# Altium project eTraceConcrete_V1_1.PrjPcb (part 2 of 7)

## Sheet battery.SchDoc
size A2
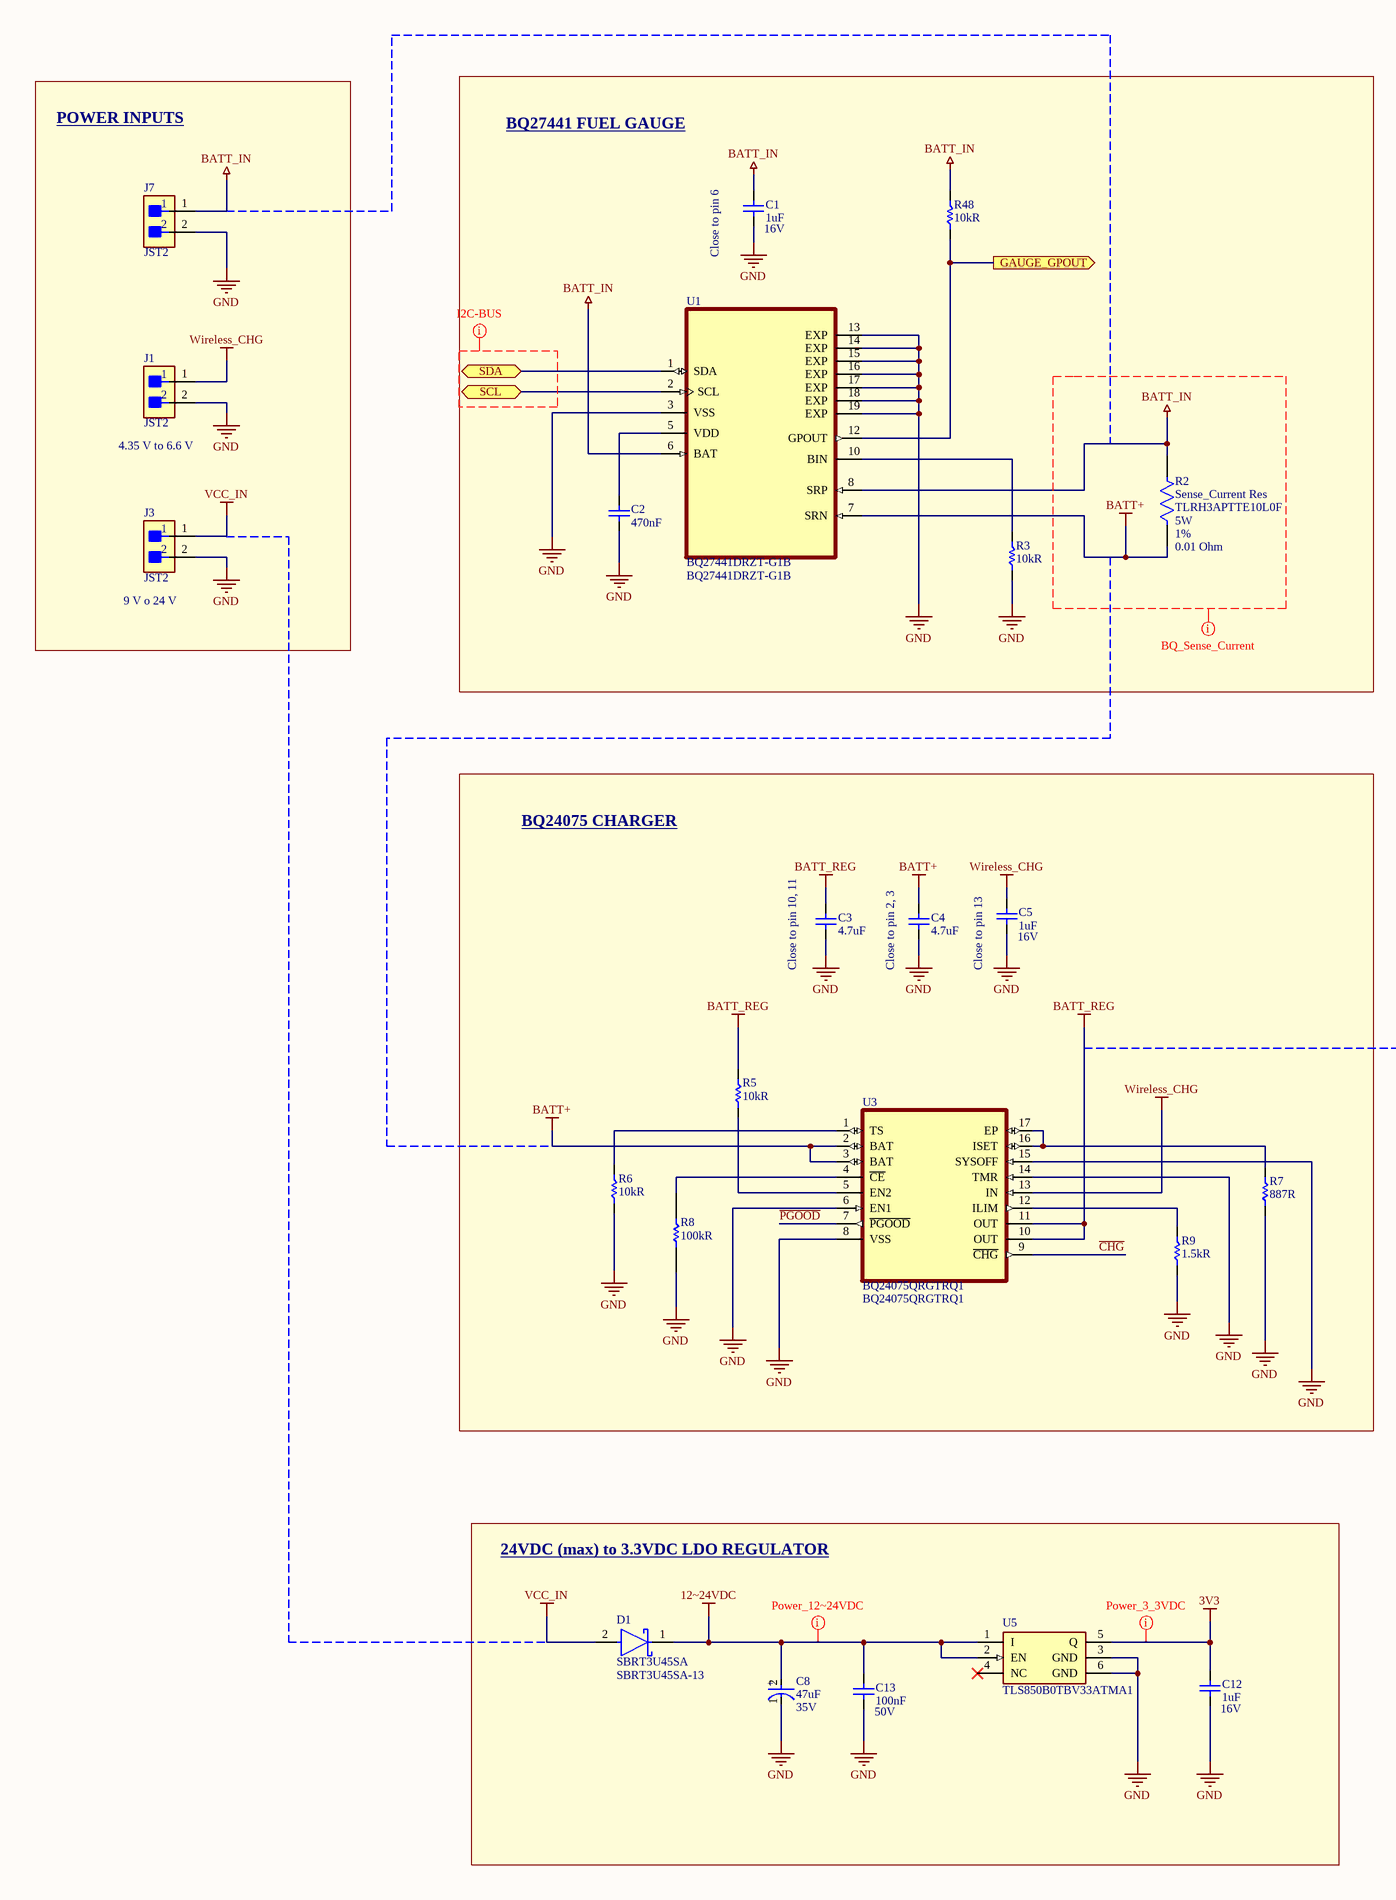
[diagram p1: battery.SchDoc, left]
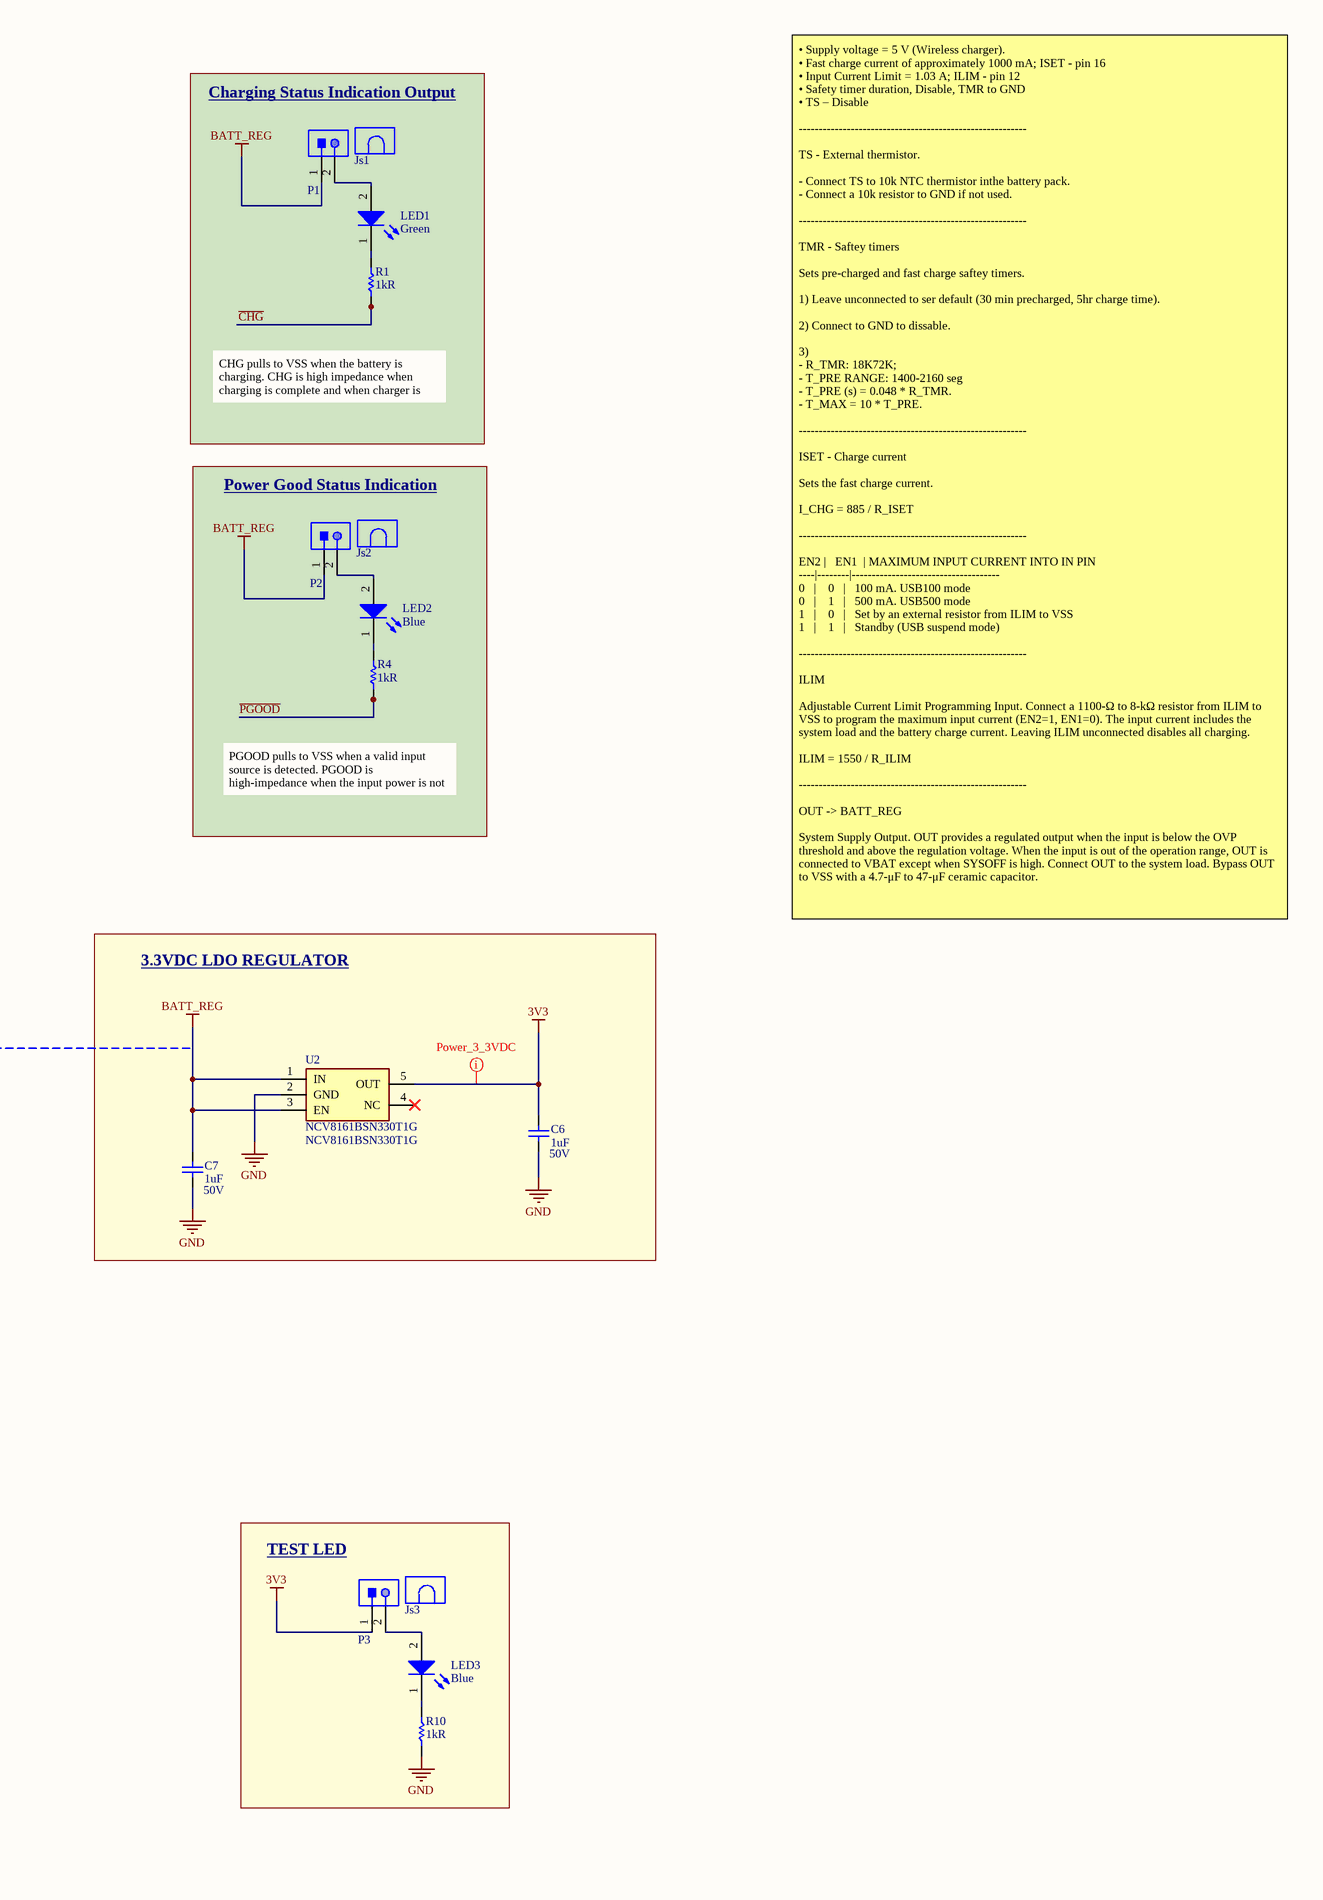
[diagram p2: battery.SchDoc, right]

### Parts
C1  1uF  Voltage Rating: 16V  [Cap 0805 (2012 Metric)]
C2  470nF  [Cap 0805 (2012 Metric)]
C3  4.7uF  [Cap 0805 (2012 Metric)]
C4  4.7uF  [Cap 0805 (2012 Metric)]
C5  1uF  Voltage Rating: 16V  [Cap 0805 (2012 Metric)]
C6  1uF  Voltage Rating: 50V  [Cap 0805 (2012 Metric)]
C7  1uF  Voltage Rating: 50V  [Cap 0805 (2012 Metric)]
C8  Capacitance: 47uF  Voltage: 35V  [EEE-FK1V470P]  (hidden comment: EEE-FK1V470P)
C12  1uF  Voltage Rating: 16V  [Cap 0805 (2012 Metric)]
C13  100nF  Voltage Rating: 50V  [Cap 0805 (2012 Metric)]
D1  SBRT3U45SA  [SBRT3U45SA-13]
J1  JST2  [JST2]
J3  JST2  [JST2]
J7  JST2  [JST2]
Js1  Jumper (2x1)  [Header JMP 2x1]  (value not drawn)
Js2  Jumper (2x1)  [Header JMP 2x1]  (value not drawn)
Js3  Jumper (2x1)  [Header JMP 2x1]  (value not drawn)
LED1  Green  [LED 0805(2012 METRIC)]
LED2  Blue  [LED 0805(2012 METRIC)]
LED3  Blue  [LED 0805(2012 METRIC)]
P1  Header 2x1  [Header 2x1]  (value not drawn)
P2  Header 2x1  [Header 2x1]  (value not drawn)
P3  Header 2x1  [Header 2x1]  (value not drawn)
R1  1kR  [Res 0805 (2012 Metric)]
R2  Sense_Current Res  value 0.01 Ohm  Manufacturer Part Number: TLRH3APTTE10L0F  Power: 5W  Tolerance: 1%  [Sense_Current Res]
R3  10kR  [Res 0805 (2012 Metric)]
R4  1kR  [Res 0805 (2012 Metric)]
R5  10kR  [Res 0805 (2012 Metric)]
R6  10kR  [Res 0805 (2012 Metric)]
R7  887R  [Res 0805 (2012 Metric)]
R8  100kR  [Res 0805 (2012 Metric)]
R9  1.5kR  [Res 0805 (2012 Metric)]
R10  1kR  [Res 0805 (2012 Metric)]
R48  10kR  [Res 0805 (2012 Metric)]
U1  BQ27441DRZT-G1B  [BQ27441DRZT-G1B]
U2  NCV8161BSN330T1G  [NCV8161BSN330T1G]
U3  BQ24075QRGTRQ1  [BQ24075QRGTRQ1]
U5  TLS850B0TBV33ATMA1  [TLS850B0TBV33ATMA1]

### Blocks framed on the sheet
POWER INPUTS: J1 J3 J7
BQ27441 FUEL GAUGE: C1 C2 R2 R3 R48 U1
Charging Status Indication Output: Js1 LED1 P1 R1
Power Good Status Indication: Js2 LED2 P2 R4
BQ24075 CHARGER: C3-C5 R5-R9 U3
3.3VDC LDO REGULATOR: C6 C7 U2
24VDC (max) to 3.3VDC LDO REGULATOR: C8 C12 C13 D1 U5
TEST LED: Js3 LED3 P3 R10

### Ports
GAUGE_GPOUT (out), SCL (bidir), SDA (bidir)

### Nets
3V3: C6.1 C12.1 P3.1 U2.5(OUT) U5.5(Q)
12~24VDC: C8.2(A) C13.1 D1.1(C) U5.1(I) U5.2(EN)
BATT+: C4.1 R2.1 U1.7(SRN) U3.2(BAT) U3.3(BAT)
BATT_IN: C1.1 J7.1 R2.2 R48.1 U1.6(BAT) U1.8(SRP)
BATT_REG: C3.1 C7.1 P1.1 P2.1 R5.1 U2.1(IN) U2.3(EN) U3.10(OUT) U3.11(OUT)
GND: C1.2 C2.2 C3.2 C4.2 C5.2 C6.2 C7.2 C8.1(C) C12.2 C13.2 J1.2 J3.2 J7.2 R3.2 R6.2 R7.2 R8.2 R9.2 R10.2 U1.3(VSS) U1.13(EXP) U1.14(EXP) U1.15(EXP) U1.16(EXP) U1.17(EXP) U1.18(EXP) U1.19(EXP) U2.2(GND) U3.6(EN1) U3.8(VSS) U3.14(TMR) U3.15(SYSOFF) U5.3(GND) U5.6(GND)  [project net BS]
VCC_IN: D1.2(A) J3.1
Wireless_CHG: C5.1 J1.1 U3.13(IN)
~{CHG}: R1.2 U3.9(~{CHG})
~{PGOOD}: R4.2 U3.7(~{PGOOD})
SCL: U1.2(SCL) ; port SCL
SDA: U1.1(SDA) ; port SDA
NetC2_1: C2.1 U1.5(VDD)
NetLED1_1: LED1.1(K) R1.1
NetLED1_2: LED1.2(A) P1.2
NetLED2_1: LED2.1(K) R4.1
NetLED2_2: LED2.2(A) P2.2
NetLED3_1: LED3.1(K) R10.1
NetLED3_2: LED3.2(A) P3.2
NetR3_1: R3.1 U1.10(BIN)
NetR5_2: R5.2 U3.5(EN2)
NetR6_1: R6.1 U3.1(TS)
NetR7_1: R7.1 U3.16(ISET) U3.17(EP)
NetR8_1: R8.1 U3.4(~{CE})
NetR9_1: R9.1 U3.12(ILIM)
NetR48_2: R48.2 U1.12(GPOUT) ; port GAUGE_GPOUT

Not connected (* = marked no-connect by the designer): U2 4(NC)*; U5 4(NC)*

### Layout directives
net class BQ_Sense_Current: BATT+, BATT_IN
net class Power_12~24VDC: 12~24VDC
net class Power_3_3VDC: 3V3
net class I2C-BUS: (no net found under the mark)

### Notes on the sheet
- (near C1) Close to pin 6
- CHG pulls to VSS when the battery is charging. CHG is high impedance when charging is complete and when charger is disabled.
- (near J1) 4.35 V to 6.6 V
- (near J3) 9 V o 24 V
- PGOOD pulls to VSS when a valid input source is detected. PGOOD is high-impedance when the input power is not within specified limits.
- • Supply voltage = 5 V (Wireless charger).
  • Fast charge current of approximately 1000 mA; ISET - pin 16
  • Input Current Limit = 1.03 A; ILIM - pin 12
  • Safety timer duration, Disable, TMR to GND
  • TS – Disable
  ---------------------------------------------------------
  TS - External thermistor.
  - Connect TS to 10k NTC thermistor inthe battery pack.
  - Connect a 10k resistor to GND if not used.
  ---------------------------------------------------------
  TMR - Saftey timers
  Sets pre-charged and fast charge saftey timers.
  1) Leave unconnected to ser default (30 min precharged, 5hr charge time).
  2) Connect to GND to dissable.
  3)
  - R_TMR: 18K72K;
  - T_PRE RANGE: 1400-2160 seg
  - T_PRE (s) = 0.048 * R_TMR.
  - T_MAX = 10 * T_PRE.
  ---------------------------------------------------------
  ISET - Charge current
  Sets the fast charge current.
  I_CHG = 885 / R_ISET
  ---------------------------------------------------------
  EN2 |   EN1  | MAXIMUM INPUT CURRENT INTO IN PIN
  ----|--------|-------------------------------------
  0   |    0   |   100 mA. USB100 mode
  0   |    1   |   500 mA. USB500 mode
  1   |    0   |   Set by an external resistor from ILIM to VSS
  1   |    1   |   Standby (USB suspend mode)
  ---------------------------------------------------------
  ILIM
  Adjustable Current Limit Programming Input. Connect a 1100-Ω to 8-kΩ resistor from ILIM to VSS to program the maximum input current (EN2=1, EN1=0). The input current includes the system load and the battery charge current. Leaving ILIM unconnected disables all charging.
  ILIM = 1550 / R_ILIM
  ---------------------------------------------------------
  OUT -> BATT_REG
  System Supply Output. OUT provides a regulated output when the input is below the OVP threshold and above the regulation voltage. When the input is out of the operation range, OUT is connected to VBAT except when SYSOFF is high. Connect OUT to the system load. Bypass OUT to VSS with a 4.7-μF to 47-μF ceramic capacitor.
- (near C3) Close to pin 10, 11
- (near C4) Close to pin 2, 3
- (near C5) Close to pin 13
- (in symbol EEE-FK1V470P) +

### Library data of the parts
C1 C5 C12 = Capacitor: Ceramic capacitor SMD-0805 1000nF /16V X7R# K +-10%, Samsung, RoHS/3000pcs/; Manufacturer Part Number: CL21B105KOFNNNG; Tolerance: 10%; Dielectric: X7R; Link: https://www.digikey.com/es/products/detail/samsung-electro-mechanics/CL21B105KOFNNNG/3894469?s=N4IgTCBcDaIMIBkwEYBCyAMBWA0geQDEA5EgcRAF0BfIA; Supplier 1: Digi-Key; Supplier Part Number 1: 1276-6471-1-ND; Manufacturer: Samsung; RoHS: Yes; Category: Ceramic Capacitors; Stock 1: 36000; Pricing 1: 1=0,10000, 10=0,05700, 50=0,03120, 100=0,02540, 500=0,01816, 1000=0,01426 (USD); Mount: Surface Mount; Case/Package: 0805; Case Code (Metric): 2012; Case Code (Imperial): 0805; Material: Ceramic; Min Operating Temperature: -55°C; Max Operating Temperature: 125°C; Package Quantity: 3000; Packaging: Tape and Reel; Capacitance: 1uF; Voltage: 16V; Series: CL; Length: 2mm; Width: 0.049inch; Height: 1.25mm; Thickness: 0.053inch; Depth: 1.25mm; Lead Free: Lead Free; ComponentLink1URL: https://datasheet.ciiva.com/25733/cl21b105kofnnng-25733281.pdf?src-supplier=Digi-Key; ComponentLink1Description: https://datasheet.ciiva.com/25733/cl21b105kofnnng-25733281.pdf?src-supplier=Digi-Key; ComponentLink2URL: https://datasheet.ciiva.com/29199/455935-da-01-en-vs-kondensator-0805-29199047.pdf?src-supplier=Conrad; ComponentLink2Description: https://datasheet.ciiva.com/29199/455935-da-01-en-vs-kondensator-0805-29199047.pdf?src-supplier=Conrad; ComponentLink3URL: https://datasheet.ciiva.com/16428/cl05b104kq5nnnc-16428885.pdf?src-supplier=Future+Electronics; ComponentLink3Description: https://datasheet.ciiva.com/16428/cl05b104kq5nnnc-16428885.pdf?src-supplier=Future+Electronics; ComponentLink4URL: https://datasheet.ciiva.com/26310/mlcc-catalogdownload2013-eng-26310156.pdf?src-supplier=Distrelec; ComponentLink4Description: https://datasheet.ciiva.com/26310/mlcc-catalogdownload2013-eng-26310156.pdf?src-supplier=Distrelec
C2 = Capacitor: CAP CER 0.47UF 25V X7R 0805; Manufacturer: Samsung; Manufacturer Part Number: CL21B474KAFNNNE; Tolerance: 10%; Link: https://www.digikey.com/en/products/detail/samsung-electro-mechanics/CL21B474KAFNNNE/3886732; Supplier 1: Digi-Key; Supplier Part Number 1: 1276-1074-1-ND; RoHS: Yes; Category: Ceramic Capacitors; Stock 1: 290187; Pricing 1: 1=0,10000, 10=0,05400, 50=0,02920, 100=0,02390, 500=0,01706, 1000=0,01341 (USD); Mount: Surface Mount; Case/Package: 0805; Case Code (Metric): 2012; Case Code (Imperial): 0805; Contact Plating: Tin; Min Operating Temperature: -55°C; Max Operating Temperature: 125°C; Capacitance: 470nF; Dielectric: X7R; Package Quantity: 1; Packaging: Tape and Reel; Voltage Rating: 25V; Series: CL; Construction: Flat; Voltage Rating (DC): 25V; Length: 2mm; Width: 0.049inch; Height: 1.25mm; Thickness: 0.053inch; Depth: 1.25mm; Radiation Hardening: No; RoHS Compliant: Yes; Lead Free: Lead Free; ComponentLink1URL: https://datasheet.ciiva.com/25799/cl21b474kafnnne-25799985.pdf?src-supplier=Digi-Key; ComponentLink1Description: https://datasheet.ciiva.com/25799/cl21b474kafnnne-25799985.pdf?src-supplier=Digi-Key; ComponentLink2URL: https://datasheet.ciiva.com/26838/getdatasheetpartid-640001-26838737.pdf?src-supplier=Verical; ComponentLink2Description: https://datasheet.ciiva.com/26838/getdatasheetpartid-640001-26838737.pdf?src-supplier=Verical
C3 C4 = Capacitor: SAMSUNG ELECTRO-MECHANICS - CL21A475KAQNNNE - SMD Multilayer Ceramic Capacitor, 4.7 µF, 25 V, 0805 [2012 Metric], ± 10%, X5R, CL Series; Voltage Rating: 25V; Link: https://www.digikey.com/en/products/detail/samsung-electro-mechanics/CL21A475KAQNNNE/3886902; Supplier 1: Digi-Key; Supplier Part Number 1: 1276-1244-1-ND; Manufacturer: Samsung; Manufacturer Part Number: CL21A475KAQNNNE; RoHS: Yes; Category: Ceramic Capacitors; Stock 1: 218144; Pricing 1: 1=0,12000, 10=0,08300, 50=0,04720, 100=0,03910, 500=0,02740, 1000=0,02268 (USD); Mount: Surface Mount; Case/Package: 0805; Case Code (Metric): 2012; Case Code (Imperial): 0805; Min Operating Temperature: -55°C; Max Operating Temperature: 85°C; Package Quantity: 1; Packaging: Tape and Reel; Capacitance: 4.7uF; Tolerance: 10%; Dielectric: X5R; Voltage Rating (DC): 25V; Series: CL; Construction: Flat; Length: 2mm; Width: 0.049inch; Height: 1.25mm; Thickness: 0.055inch; Depth: 1.25mm; Radiation Hardening: No; Lead Free: Lead Free; RoHS Compliant: Yes; ComponentLink1URL: https://datasheet.ciiva.com/25798/cl21a475kaqnnne-25798882.pdf?src-supplier=Digi-Key; ComponentLink1Description: https://datasheet.ciiva.com/25798/cl21a475kaqnnne-25798882.pdf?src-supplier=Digi-Key
C6 C7 = Capacitor: Cap Ceramic 1uF 50V Y5V -20% to 80% SMD 0805 85C T/R; Manufacturer: Samsung; Manufacturer Part Number: CL21F105ZBFNNNG; Link: https://www.digikey.com/en/products/detail/samsung-electro-mechanics/CL21F105ZBFNNNG/3894627; Supplier 1: Digi-Key; Supplier Part Number 1: 1276-6495-1-ND; RoHS: Yes; Category: Ceramic Capacitors; Stock 1: 53286; Pricing 1: 1=0,14000, 10=0,10300, 50=0,05840, 100=0,04840, 500=0,03396, 1000=0,02811 (USD); Mount: Surface Mount; Case/Package: 0805; Case Code (Metric): 2012; Case Code (Imperial): 0805; Material: Ceramic; Min Operating Temperature: -30°C; Max Operating Temperature: 85°C; Tolerance: 80%; Packaging: Tape and Reel; Capacitance: 1uF; Package Quantity: 3000; Dielectric: Y5V; Length: 2mm; Width: 0.049inch; Thickness: 0.053inch; Depth: 1.25mm; Radiation Hardening: No; Lead Free: Lead Free; RoHS Compliant: Yes; ComponentLink1URL: https://datasheet.ciiva.com/25734/cl21f105zbfnnng-25734639.pdf?src-supplier=Digi-Key; ComponentLink1Description: https://datasheet.ciiva.com/25734/cl21f105zbfnnng-25734639.pdf?src-supplier=Digi-Key; ComponentLink2URL: https://datasheet.ciiva.com/26838/getdatasheetpartid-650871-26838829.pdf?src-supplier=Verical; ComponentLink2Description: https://datasheet.ciiva.com/26838/getdatasheetpartid-650871-26838829.pdf?src-supplier=Verical; ComponentLink3URL: https://datasheet.ciiva.com/29199/455947-da-01-en-vs-kondensator-0805-29199048.pdf?src-supplier=Conrad; ComponentLink3Description: https://datasheet.ciiva.com/29199/455947-da-01-en-vs-kondensator-0805-29199048.pdf?src-supplier=Conrad; ComponentLink4URL: https://datasheet.ciiva.com/26310/mlcc-catalogdownload2013-eng-26310157.pdf?src-supplier=Distrelec; ComponentLink4Description: https://datasheet.ciiva.com/26310/mlcc-catalogdownload2013-eng-26310157.pdf?src-supplier=Distrelec; ComponentLink5URL: https://datasheet.ciiva.com/16437/cl05b104kq5nnnc-16437223.pdf?src-supplier=Future+Electronics; ComponentLink5Description: https://datasheet.ciiva.com/16437/cl05b104kq5nnnc-16437223.pdf?src-supplier=Future+Electronics
C8 = EEE-FK1V470P: Capacitor 47 uF 35 VDC, EEEFK1V470P, Panasonic Automotive & Industrial Systems; Dielectric Material: Aluminium; Tolerance: 20%; Ripple Current: 240mA; Polarity: Polar; Life (Hours): 2000Hour; ESR (Equivalent Series Resistance): 360mR; Leakage Current: 3uA; Supplier 1: Future Electronics; Manufacturer: Panasonic; RoHS: Yes; Category: Aluminum Electrolytic Capacitors; Stock 1: 165; Mount: Surface Mount,PCB; Case/Package: Radial; Number of Pins: 2; Material: Aluminium; Contact Plating: Tin; Min Operating Temperature: -55°C; Max Operating Temperature: 105°C; Packaging: Tape and Reel; Voltage Rating: 35V; Package Quantity: 1000; Termination: SMD/SMT; Ripple Current (AC): 240mA; Voltage Rating (DC): 35V; Series: FK; Construction: Cylindrical; Diameter: 6.3mm; Length: 5.8mm; Width: 7.8mm; Height: 5.8mm; Height - Seated (Max): 0.24inch; Radiation Hardening: No; RoHS Compliant: Yes; REACH SVHC: No SVHC; Lead Free: Lead Free; ComponentLink1URL: https://datasheet.ciiva.com/11777/0900766b80e4e8b0-11777384.pdf?src-supplier=RSComponents; ComponentLink1Description: https://datasheet.ciiva.com/11777/0900766b80e4e8b0-11777384.pdf?src-supplier=RSComponents; ComponentLink2URL: https://datasheet.ciiva.com/34302/1358354-34302248.pdf?src-supplier=Jameco; ComponentLink2Description: https://datasheet.ciiva.com/34302/1358354-34302248.pdf?src-supplier=Jameco; ComponentLink3URL: https://datasheet.ciiva.com/29313/443478-da-01-en-smd-elko-vfk-d-47-uf-35v-29313582.pdf?src-supplier=Conrad; ComponentLink3Description: https://datasheet.ciiva.com/29313/443478-da-01-en-smd-elko-vfk-d-47-uf-35v-29313582.pdf?src-supplier=Conrad; ComponentLink4URL: https://datasheet.ciiva.com/10327/aba0000ce120-10327226.pdf?src-supplier=Avnet; ComponentLink4Description: https://datasheet.ciiva.com/10327/aba0000ce120-10327226.pdf?src-supplier=Avnet; ComponentLink5URL: https://datasheet.ciiva.com/5949/1676921-5949767.pdf?src-supplier=Farnell; ComponentLink5Description: https://datasheet.ciiva.com/5949/1676921-5949767.pdf?src-supplier=Farnell; ComponentLink6URL: https://datasheet.ciiva.com/2983/aba0000ce120-2983977.pdf?src-supplier=Avnet; ComponentLink6Description: https://datasheet.ciiva.com/2983/aba0000ce120-2983977.pdf?src-supplier=Avnet; ComponentLink7URL: https://datasheet.ciiva.com/24022/aba0000ce120-24022141.pdf?src-supplier=Mouser; ComponentLink7Description: https://datasheet.ciiva.com/24022/aba0000ce120-24022141.pdf?src-supplier=Mouser; ComponentLink8URL: https://datasheet.ciiva.com/46388/1676921-46388169.pdf?src-supplier=Element14; ComponentLink8Description: https://datasheet.ciiva.com/46388/1676921-46388169.pdf?src-supplier=Element14; ComponentLink9URL: https://datasheet.ciiva.com/16449/aba0000ce120-16449455.pdf?src-supplier=Future+Electronics; ComponentLink9Description: https://datasheet.ciiva.com/16449/aba0000ce120-16449455.pdf?src-supplier=Future+Electronics; ComponentLink10URL: https://datasheet.ciiva.com/14592/70068178-14592806.pdf?src-supplier=Allied+Electronics; ComponentLink10Description: https://datasheet.ciiva.com/14592/70068178-14592806.pdf?src-supplier=Allied+Electronics; ComponentLink11URL: https://datasheet.ciiva.com/46376/1676921-46376749.pdf?src-supplier=Element14; ComponentLink11Description: https://datasheet.ciiva.com/46376/1676921-46376749.pdf?src-supplier=Element14; ComponentLink12URL: https://datasheet.ciiva.com/48524/fk-eng-tds-48524111.pdf?src-supplier=Distrelec; ComponentLink12Description: https://datasheet.ciiva.com/48524/fk-eng-tds-48524111.pdf?src-supplier=Distrelec; ComponentLink13URL: https://datasheet.ciiva.com/14605/70258115-14605496.pdf?src-supplier=Allied+Electronics; ComponentLink13Description: https://datasheet.ciiva.com/14605/70258115-14605496.pdf?src-supplier=Allied+Electronics; ComponentLink14URL: https://datasheet.ciiva.com/14608/70258115-14608444.pdf?src-supplier=Allied+Electronics; ComponentLink14Description: https://datasheet.ciiva.com/14608/70258115-14608444.pdf?src-supplier=Allied+Electronics; Link: https://www.digikey.com/es/products/detail/panasonic-electronic-components/EEE-FK1V470P/766010?s=N4IgTCBcDaIKIILQDEDSBGAagFgOwAYAFEAXQF8g; Supplier Part Number 1: 5098671; Manufacturer Part Number: EEEFK1V470P; Pricing 1: 1=0,42500, 50=0,32500, 100=0,30500, 250=0,29000, 500=0,27500 (USD); Impedance: 360mR
C13 = Capacitor: YAGEO (PHYCOMP)         CC0805ZRY5V9BB104             SMD Multilayer Ceramic Capacitor, 0805 [2012 Metric], 0.1 uF, 50 V, +80%, -20%, Y5V, CC Series; Tolerance: 80%; Link: https://www.digikey.com/es/products/detail/yageo/CC0805ZRY5V9BB104/2103099?s=N4IgTCBcDaIMJwAwA5EFYBaAlAmmgagJwBCxAjIgCwgC6AvkA; Supplier 1: Digi-Key; Supplier Part Number 1: 311-1361-1-ND; Manufacturer: Yageo; Manufacturer Part Number: CC0805ZRY5V9BB104; RoHS: Yes; Category: Ceramic Capacitors; Stock 1: 92689; Pricing 1: 1=0,10000, 10=0,07000, 50=0,03800, 100=0,03100, 500=0,02214, 1000=0,01739 (USD); Mount: Surface Mount; Case/Package: 0805; Number of Pins: 2; Case Code (Metric): 2012; Case Code (Imperial): 0805; Material: Ceramic; Dielectric Material: Ceramic; Min Operating Temperature: -30°C; Max Operating Temperature: 85°C; Capacitance: 100nF; Dielectric: Y5V; Package Quantity: 1; Packaging: Tape and Reel; Voltage Rating (DC): 50V; Termination: SMD/SMT; Resistor Type: Ceramic; Series: CC; Construction: Flat; Length: 2mm; Width: 0.049inch; Height: 0.6mm; Depth: 1.25mm; Thickness: 0.024inch; Radiation Hardening: No; REACH SVHC: No SVHC; Lead Free: Lead Free; Halogen Free: Halogen Free; RoHS Compliant: Yes; ComponentLink1URL: https://datasheet.ciiva.com/144/mlccorderingcode-144209.pdf?src-supplier=Digi-Key; ComponentLink1Description: https://datasheet.ciiva.com/144/mlccorderingcode-144209.pdf?src-supplier=Digi-Key; ComponentLink2URL: https://datasheet.ciiva.com/144/mlccorderingcode-144210.pdf?src-supplier=Digi-Key; ComponentLink2Description: https://datasheet.ciiva.com/144/mlccorderingcode-144210.pdf?src-supplier=Digi-Key; ComponentLink3URL: https://datasheet.ciiva.com/144/mlccorderingcode-144211.pdf?src-supplier=Digi-Key; ComponentLink3Description: https://datasheet.ciiva.com/144/mlccorderingcode-144211.pdf?src-supplier=Digi-Key; ComponentLink4URL: https://datasheet.ciiva.com/11465/upy-gphc-y5v-6-3v-to-50v-5-11465865.pdf?src-supplier=Avnet; ComponentLink4Description: https://datasheet.ciiva.com/11465/upy-gphc-y5v-6-3v-to-50v-5-11465865.pdf?src-supplier=Avnet; ComponentLink5URL: https://datasheet.ciiva.com/13389/upy-gp-np0-16v-to-50v-8-13389351.pdf?src-supplier=Mouser; ComponentLink5Description: https://datasheet.ciiva.com/13389/upy-gp-np0-16v-to-50v-8-13389351.pdf?src-supplier=Mouser; ComponentLink6URL: https://datasheet.ciiva.com/17435/upy-gphc-y5v-6-3v-to-50v-5-17435053.pdf?src-supplier=Avnet+Europe; ComponentLink6Description: https://datasheet.ciiva.com/17435/upy-gphc-y5v-6-3v-to-50v-5-17435053.pdf?src-supplier=Avnet+Europe; ComponentLink7URL: https://datasheet.ciiva.com/15189/getdatasheetpartid-55882-15189238.pdf?src-supplier=Verical; ComponentLink7Description: https://datasheet.ciiva.com/15189/getdatasheetpartid-55882-15189238.pdf?src-supplier=Verical; ComponentLink8URL: https://datasheet.ciiva.com/16747/upy-gphc-y5v-6-3v-to-50v-5-revised-16747323.pdf?src-supplier=Future+Electronics; ComponentLink8Description: https://datasheet.ciiva.com/16747/upy-gphc-y5v-6-3v-to-50v-5-revised-16747323.pdf?src-supplier=Future+Electronics; ComponentLink9URL: https://datasheet.ciiva.com/28450/1132289-28450870.pdf?src-supplier=Element14; ComponentLink9Description: https://datasheet.ciiva.com/28450/1132289-28450870.pdf?src-supplier=Element14; ComponentLink10URL: https://datasheet.ciiva.com/29241/445331-da-01-en-kerko-chip-0805-y5v0-1uf-20-80proz50vg-29241946.pdf?src-supplier=Conrad; ComponentLink10Description: https://datasheet.ciiva.com/29241/445331-da-01-en-kerko-chip-0805-y5v0-1uf-20-80proz50vg-29241946.pdf?src-supplier=Conrad
D1 = SBRT3U45SA: DIODE SBR 45V 3A SMA; Manufacturer: Diodes; Element Configuration: Single; Forward Voltage: 420mV; Max Forward Surge Current (Ifsm): 50A; Max Reverse Current: 40mA; Supplier 1: Digi-Key; RoHS: Yes; Category: Rectifier Diodes; Stock 1: 387; Mount: Surface Mount; Case/Package: SMA; Weight: 0.002258oz; Min Operating Temperature: -55°C; Max Operating Temperature: 150°C; Packaging: Tape and Reel; Average Rectified Current: 3A; Max Repetitive Reverse Voltage (Vrrm): 45V; Package Quantity: 5000; Max Reverse Voltage (DC): 45V; Lead Free: Lead Free; RoHS Compliant: Yes; ComponentLink1URL: http://www.mouser.com/ds/2/115/SBRT3U45SA-527766.pdf?src-supplier=Mouser; ComponentLink1Description: http://www.mouser.com/ds/2/115/SBRT3U45SA-527766.pdf?src-supplier=Mouser; ComponentLink2URL: http://diodes.com/datasheets/sbr/SBRT3U45SA.pdf?src-supplier=Avnet; ComponentLink2Description: http://diodes.com/datasheets/sbr/SBRT3U45SA.pdf?src-supplier=Avnet; ComponentLink3URL: https://www.diodes.com/assets/Datasheets/SBRT3U45SA.pdf?src-supplier=Digi-Key; ComponentLink3Description: https://www.diodes.com/assets/Datasheets/SBRT3U45SA.pdf?src-supplier=Digi-Key; Supplier Part Number 1: SBRT3U45SA-13DICT-ND; Pricing 1: 1=0,41000, 10=0,33600, 100=0,22880, 500=0,17160, 1000=0,12870, 2000=0,11798 (USD); Link: https://www.digikey.com/es/products/detail/diodes-incorporated/SBRT3U45SA-13/4869049?s=N4IgTCBcDaIMoCEBKAVAzAVQCwFY4EEBaARjRAF0BfIA; Manufacturer Part Number: SBRT3U45SA-13
J1 J3 J7 = JST2: Conn Shrouded Header (4 Sides) HDR 2 POS 2.5mm Solder ST Thru-Hole Box; Manufacturer: JST; Manufacturer Part Number: B2B-XH-A(LF)(SN); Number of Positions: 2; Connector Type: Male Pin; Contact Resistance: 20mR; Max Current Rating: 3A; Max Voltage Rating (AC): 250V; Insulation Resistance: 1GR; Wire/Cable Gauge: 22AWG; Supplier 1: Farnell; RoHS: Yes; Category: FFC / FPC; Stock 1: 212689; Mount: Through Hole; Contact Plating: Tin,Copper,Lead; Color: Natural; Contact Material: Brass; Housing Material: Polyamide; Housing Color: White; Min Operating Temperature: -25°C; Max Operating Temperature: 85°C; Termination: Solder; Number of Rows: 1; Packaging: Bulk; Series: XH; Contact Type: Male Pin; Fastening Type: Detent; Orientation: Straight; Current Rating: 3A; Voltage Rating: 250V; Voltage Rating (AC): 250V; Number of Contacts: 2; Max Voltage Rating (DC): 250V; Length: 7.4mm; Pitch: 2.5mm; Depth: 5.75mm; Lead Pitch: 2.5mm; Lead Free: Lead Free; REACH SVHC: No SVHC; ComponentLink1URL: https://datasheet.ciiva.com/26894/getdatasheetpartid-640357-26894434.pdf?src-supplier=Verical; ComponentLink1Description: https://datasheet.ciiva.com/26894/getdatasheetpartid-640357-26894434.pdf?src-supplier=Verical; ComponentLink2URL: https://datasheet.ciiva.com/26894/getdatasheetpartid-385291-26894760.pdf?src-supplier=Verical; ComponentLink2Description: https://datasheet.ciiva.com/26894/getdatasheetpartid-385291-26894760.pdf?src-supplier=Verical; ComponentLink3URL: https://datasheet.ciiva.com/11746/0900766b8082653e-11746979.pdf?src-supplier=RSComponents; ComponentLink3Description: https://datasheet.ciiva.com/11746/0900766b8082653e-11746979.pdf?src-supplier=RSComponents; ComponentLink4URL: https://datasheet.ciiva.com/20207/523653-20207167.pdf?src-supplier=Rapid+Electronics; ComponentLink4Description: https://datasheet.ciiva.com/20207/523653-20207167.pdf?src-supplier=Rapid+Electronics; ComponentLink5URL: https://datasheet.ciiva.com/8052/5448-8052024.pdf?src-supplier=Element14; ComponentLink5Description: https://datasheet.ciiva.com/8052/5448-8052024.pdf?src-supplier=Element14; Supplier Part Number 1: 1516276; Pricing 1: 100=0,06860, 1000=0,04800, 2500=0,04520, 5000=0,04230, 10000=0,03950, 20000=0,03660 (GBP); Link: https://www.digikey.com/es/products/detail/jst-sales-america-inc/B2B-XH-A-LF-SN/1651045?s=N4IgTCBcDaIEJjgWgBoAkkEEAUAZAYgJTYDKAcoSALoC%2BQA
Js1-Js3 = Jumper (2x1): 2 (1 x 2) Position Shunt Connector Black Open Top 0.100" (2.54mm) Gold; Manufacturer: Sullins; Manufacturer Part Number: QPC02SXGN-RC; Number of Positions: 2; Pitch: 0.1inch; Link: https://www.digikey.com/product-detail/en/sullins-connector-solutions/QPC02SXGN-RC/S9337-ND/2618262; Supplier 1: Digi-Key; Supplier Part Number 1: S9337-ND; RoHS: Yes; Category: Connectors; Stock 1: 529611; Pricing 1: 1=0,10000, 10=0,05900, 25=0,04400, 50=0,03780, 100=0,03650, 250=0,03152, 500=0,03024, 1000=0,02646, 2500=0,02394 (USD); Case/Package: 100; Contact Plating: Gold; Package Quantity: 2000; Packaging: Bulk; Height: 0.235inch; Lead Free: Lead Free; ComponentLink1URL: https://datasheet.ciiva.com/767/284-sxgn-11510-767869.pdf?src-supplier=Digi-Key; ComponentLink1Description: https://datasheet.ciiva.com/767/284-sxgn-11510-767869.pdf?src-supplier=Digi-Key
LED1 = LED: LED GREEN CLEAR 0805 SMD; Manufacturer: Wurth Electronics; Manufacturer Part Number: 150080VS75000; Luminous Intensity: 40mcd; Forward Current: 30mA; Forward Voltage: 2V; Viewing Angle: 140°; Wavelength: 570nm; Lens Style: Clear,Rectangular; Test Current: 20mA; Link: https://www.digikey.com/es/products/detail/w%C3%BCrth-elektronik/150080VS75000/4489924; Supplier 1: Digi-Key; Supplier Part Number 1: 732-4986-1-ND; RoHS: Yes; Category: LEDs; Stock 1: 15673; Pricing 1: 1=0,18000, 50=0,17100, 100=0,14700, 500=0,12700 (USD); Mount: Surface Mount; Case/Package: 0805; Color: Green; Case Code (Metric): 2012; Case Code (Imperial): 0805; Min Operating Temperature: -40°C; Max Operating Temperature: 85°C; Package Quantity: 4000; Packaging: Tape and Reel; Dominant Wavelength: 570nm; Length: 2mm; Width: 1.25mm; Height: 0.7mm; REACH SVHC: Unknown; ComponentLink1URL: https://datasheet.ciiva.com/22656/150080vs75000-22656966.pdf?src-supplier=Element14; ComponentLink1Description: https://datasheet.ciiva.com/22656/150080vs75000-22656966.pdf?src-supplier=Element14; ComponentLink2URL: https://datasheet.ciiva.com/29279/759437-da-01-en-chipled-0805-w-kl-h-gruen-150080vs7500-29279047.pdf?src-supplier=Conrad; ComponentLink2Description: https://datasheet.ciiva.com/29279/759437-da-01-en-chipled-0805-w-kl-h-gruen-150080vs7500-29279047.pdf?src-supplier=Conrad; ComponentLink3URL: https://datasheet.ciiva.com/29563/150080vs75000-29563018.pdf?src-supplier=Digi-Key; ComponentLink3Description: https://datasheet.ciiva.com/29563/150080vs75000-29563018.pdf?src-supplier=Digi-Key
LED2 LED3 = LED: SMD LED blue 3.5 V 0805, 150080BS75000, Würth Elektronik; Manufacturer: Wurth Electronics; Luminous Intensity: 145mcd; Viewing Angle: 140°; Forward Voltage: 3.2V; Wavelength: 470nm; Lens Style: Clear,Rectangular; Forward Current: 30mA; Test Current: 20mA; Link: https://www.digikey.com/es/products/detail/w%C3%BCrth-elektronik/150080BS75000/4489912?s=N4IgTCBcDaIIwFYAMSAcSBCBlA7MlIAugL5A; Supplier 1: Digi-Key; Supplier Part Number 1: 732-4982-1-ND; Manufacturer Part Number: 150080BS75000; RoHS: Yes; Category: LEDs; Stock 1: 46506; Pricing 1: 1=0,18000, 50=0,16500, 100=0,14200, 500=0,12300 (USD); Mount: Surface Mount; Case/Package: 0805; Color: Blue; Case Code (Metric): 2012; Case Code (Imperial): 0805; Min Operating Temperature: -40°C; Max Operating Temperature: 85°C; Package Quantity: 4000; Packaging: Tape and Reel; Dominant Wavelength: 470nm; Length: 2mm; Width: 1.25mm; Height: 0.7mm; REACH SVHC: Unknown; RoHS Compliant: Yes; Lead Free: Lead Free; ComponentLink1URL: https://datasheet.ciiva.com/22656/1740214-22656954.pdf?src-supplier=Element14; ComponentLink1Description: https://datasheet.ciiva.com/22656/1740214-22656954.pdf?src-supplier=Element14; ComponentLink2URL: https://datasheet.ciiva.com/23843/150080bs75000-23843251.pdf?src-supplier=Newark; ComponentLink2Description: https://datasheet.ciiva.com/23843/150080bs75000-23843251.pdf?src-supplier=Newark; ComponentLink3URL: https://datasheet.ciiva.com/29279/759433-da-01-en-chipled-0805-w-kl-blau-150080bs75000-29279203.pdf?src-supplier=Conrad; ComponentLink3Description: https://datasheet.ciiva.com/29279/759433-da-01-en-chipled-0805-w-kl-blau-150080bs75000-29279203.pdf?src-supplier=Conrad; ComponentLink4URL: https://datasheet.ciiva.com/29562/150080bs75000-29562922.pdf?src-supplier=Digi-Key; ComponentLink4Description: https://datasheet.ciiva.com/29562/150080bs75000-29562922.pdf?src-supplier=Digi-Key; ComponentLink5URL: https://datasheet.ciiva.com/29562/150080bs75000-29562923.pdf?src-supplier=Digi-Key; ComponentLink5Description: https://datasheet.ciiva.com/29562/150080bs75000-29562923.pdf?src-supplier=Digi-Key
P1-P3 = Header 2x1: Connector Header Through Hole 2 position 0.100" (2.54mm); Manufacturer: Amphenol FCI; Manufacturer Part Number: 68001-402HLF; Number of Contacts: 2; Connector Type: Male Pin; Insulation Resistance: 5GR; Max Voltage Rating (AC): 1.5kV; Gender: Male; Current Rating: 3A; Contact Post Length: 3.05mm; Link: https://www.digikey.com/product-detail/en/amphenol-icc-fci/68001-402HLF/609-3507-ND/1530472; Supplier 1: Digi-Key; Supplier Part Number 1: 609-3507-ND; RoHS: Yes; Category: Headers and Wire Housings; Stock 1: 5598; Pricing 1: 1=0,12000, 10=0,11600, 100=0,07160, 500=0,05928, 1000=0,05187, 5000=0,04446, 10000=0,04323 (USD); Mount: Through Hole; Contact Plating: Tin; Housing Material: Thermoplastic; Housing Color: Black; Color: Black; Contact Material: Bronze; Min Operating Temperature: -65°C; Max Operating Temperature: 125°C; Termination: Solder; Number of Rows: 1; Number of Positions: 2; Orientation: Straight; Package Quantity: 100; Packaging: Bulk; Contact Gender: Male; Voltage Rating: 1.5kV; Length: 5.08mm; Pitch: 2.54mm; Contact Mating Length: 0.23inch; Depth: 2.41mm; Radiation Hardening: No; REACH SVHC: No SVHC; Flammability Rating: UL94 V-0; Lead Free: Lead Free; ComponentLink1URL: https://datasheet.ciiva.com/724/68000-724389.pdf?src-supplier=Digi-Key; ComponentLink1Description: https://datasheet.ciiva.com/724/68000-724389.pdf?src-supplier=Digi-Key; ComponentLink2URL: https://datasheet.ciiva.com/16726/68000-16726185.pdf?src-supplier=Avnet+Europe; ComponentLink2Description: https://datasheet.ciiva.com/16726/68000-16726185.pdf?src-supplier=Avnet+Europe; ComponentLink3URL: https://datasheet.ciiva.com/10149/68000-10149338.pdf?src-supplier=Avnet; ComponentLink3Description: https://datasheet.ciiva.com/10149/68000-10149338.pdf?src-supplier=Avnet; ComponentLink4URL: https://datasheet.ciiva.com/46385/1748756-46385306.pdf?src-supplier=Element14; ComponentLink4Description: https://datasheet.ciiva.com/46385/1748756-46385306.pdf?src-supplier=Element14
R1 R4 R10 = Resistor: RES 1K OHM 1% 1/4W 0805; Manufacturer: Stackpole Electronics; Manufacturer Part Number: RNCP0805FTD1K00; Power Rating: 250mW; Temperature Coefficient: 100ppm/°C; Link: https://www.digikey.com/es/products/detail/stackpole-electronics-inc/RNCP0805FTD1K00/2240229?s=N4IgTCBcDaIEoDkDCAFADADjQVgGIBUARARgGk00QBdAXyA; Supplier 1: Digi-Key; Supplier Part Number 1: RNCP0805FTD1K00CT-ND; RoHS: Yes; Category: Chip SMD Resistors; Stock 1: 316834; Pricing 1: 1=0,10000, 10=0,07000, 100=0,02830, 1000=0,01272, 2500=0,01104 (USD); Mount: Surface Mount; Case/Package: 0805; Case Code (Metric): 2012; Case Code (Imperial): 0805; Size Code: 0805; Min Operating Temperature: -55°C; Max Operating Temperature: 155°C; Tolerance: 1%; Resistance: 1kR; Packaging: Tape and Reel; Resistor Type: Thin Film; Number of Terminations: 2; Max Power Dissipation: 250mW; Features: Moisture Resistant,Anti-Sulfur; Series: RNCP; Length: 0.079inch; Width: 0.049inch; Height: 0.024inch; Lead Free: Lead Free; RoHS Compliant: Yes; ComponentLink1URL: https://www.seielect.com/catalog/SEI-Packaging.pdf?src-supplier=Digi-Key; ComponentLink1Description: https://www.seielect.com/catalog/SEI-Packaging.pdf?src-supplier=Digi-Key; ComponentLink2URL: https://www.seielect.com/Catalog/SEI-rncp.pdf?src-supplier=Digi-Key; ComponentLink2Description: https://www.seielect.com/Catalog/SEI-rncp.pdf?src-supplier=Digi-Key; ComponentLink3URL: http://www.seielect.com/Catalog/SEI-rncp.pdf?src-supplier=Future+Electronics; ComponentLink3Description: http://www.seielect.com/Catalog/SEI-rncp.pdf?src-supplier=Future+Electronics
R2 = Sense_Current Res: Res Metal Plate 2512 0.01 Ohm 1% 5W ±75ppm/C Pad SMD Automotive T/R; Manufacturer: KOA Speer; Supplier 1: Digi-Key; RoHS: Yes; Category: Chip SMD Resistors; Stock 1: 3744; RoHS Compliant: Yes; ComponentLink1URL: http://www.mouser.com/ds/2/219/TLR-2BW-2BP-2HW-3AP-3APS-1100841.pdf?src-supplier=Mouser; ComponentLink1Description: http://www.mouser.com/ds/2/219/TLR-2BW-2BP-2HW-3AP-3APS-1100841.pdf?src-supplier=Mouser; Pricing 1: 1=1,58000, 10=1,39500, 25=1,28240, 50=1,17000, 100=1,01250, 250=0,85500, 500=0,72000, 1000=0,59850 (USD); Supplier Part Number 1: 2019-TLRH3APTTE10L0FCT-ND; Link: https://www.digikey.com/en/products/detail/koa-speer-electronics-inc/TLRH3APTTE10L0F/9845480
R3 R5 R6 R48 = Resistor: RES 10K OHM 1% 1/4W 0805; Manufacturer: Stackpole Electronics; Manufacturer Part Number: RNCP0805FTD10K0; Max Power Dissipation: 250mW; Temperature Coefficient: 100ppm/°C; Link: https://www.digikey.com/en/products/detail/stackpole-electronics-inc/RNCP0805FTD10K0/2240262; Supplier 1: Digi-Key; Supplier Part Number 1: RNCP0805FTD10K0CT-ND; RoHS: Yes; Category: Chip SMD Resistors; Stock 1: 271706; Pricing 1: 1=0,10000, 10=0,07300, 100=0,02970, 1000=0,01336, 2500=0,01159 (USD); Mount: Surface Mount; Case/Package: 0805; Case Code (Metric): 2012; Case Code (Imperial): 0805; Min Operating Temperature: -55°C; Max Operating Temperature: 155°C; Resistance: 10kR; Tolerance: 1%; Packaging: Tape and Reel; Resistor Type: Thin Film; Number of Terminations: 2; Features: Moisture Resistant,Anti-Sulfur; Series: RNCP; Length: 0.079inch; Width: 0.049inch; Height: 0.024inch; Lead Free: Lead Free; RoHS Compliant: Yes; ComponentLink1URL: https://www.seielect.com/catalog/SEI-Packaging.pdf?src-supplier=Digi-Key; ComponentLink1Description: https://www.seielect.com/catalog/SEI-Packaging.pdf?src-supplier=Digi-Key
R7 = Resistor: Res Thick Film 0805 887 Ohm 1% 1/8W 100ppm/C Molded SMD SMD Paper T/R; Manufacturer: Yageo; Manufacturer Part Number: RC0805FR-07887RL; Temperature Coefficient: 100ppm/°C; Power Rating: 125mW; Voltage Rating: 150V; Link: https://www.digikey.com/en/products/detail/yageo/RC0805FR-07887RL/728182; Supplier 1: Digi-Key; Supplier Part Number 1: 311-887CRCT-ND; RoHS: Yes; Category: Chip SMD Resistors; Stock 1: 47793; Pricing 1: 1=0,10000, 10=0,04200, 100=0,01690, 1000=0,00759, 2500=0,00659 (USD); Case/Package: 0805; Contact Plating: Tin,Lead,Matte; Case Code (Imperial): 0805; Case Code (Metric): 2012; Min Operating Temperature: -55°C; Max Operating Temperature: 155°C; Resistance: 887R; Tolerance: 1%; Resistor Type: Thick Film; Packaging: Tape and Reel; Package Quantity: 1; Termination: SMD/SMT; Number of Terminations: 2; Max Power Dissipation: 125mW; Voltage Rating (DC): 150V; Features: Moisture Resistant; Series: RC; Construction: Rectangular; Length: 2mm; Width: 1.25mm; Height: 0.024inch; Depth: 1.25mm; Radiation Hardening: No; Military Standard: Not; Lead Free: Lead Free; RoHS Compliant: Yes; ComponentLink1URL: https://datasheet.ciiva.com/2457/pyu-r-int-thick-7-2457431.pdf?src-supplier=Digi-Key; ComponentLink1Description: https://datasheet.ciiva.com/2457/pyu-r-int-thick-7-2457431.pdf?src-supplier=Digi-Key; ComponentLink2URL: https://datasheet.ciiva.com/2457/pyu-r-int-thick-7-2457432.pdf?src-supplier=Digi-Key; ComponentLink2Description: https://datasheet.ciiva.com/2457/pyu-r-int-thick-7-2457432.pdf?src-supplier=Digi-Key; ComponentLink3URL: https://datasheet.ciiva.com/2457/pyu-r-int-thick-7-2457433.pdf?src-supplier=Digi-Key; ComponentLink3Description: https://datasheet.ciiva.com/2457/pyu-r-int-thick-7-2457433.pdf?src-supplier=Digi-Key
R8 = Resistor: YAGEO         RC0805FR-07100KL            RES, THICK FILM, 100K, 1%, 0.125W, 0805, REEL; Temperature Coefficient: 100ppm/°C; Power Rating: 125mW; Voltage Rating (DC): 150V; Link: https://www.digikey.com/products/en/resistors/chip-resistor-surface-mount/52?k=RC0805FR-07100KL&k=&pkeyword=RC0805FR-07100KL&sv=0&pv7=2&sf=0&quantity=&ColumnSort=0&page=1&pageSize=25; Supplier 1: Digi-Key; Supplier Part Number 1: 311-100KCRCT-ND; Manufacturer: Yageo; Manufacturer Part Number: RC0805FR-07100KL; RoHS: Yes; Category: Chip SMD Resistors; Stock 1: 4114962; Pricing 1: 1=0,10000, 10=0,04000, 100=0,01630, 1000=0,00731, 2500=0,00635 (USD); Case/Package: 0805; Number of Pins: 2; Case Code (Metric): 2012; Case Code (Imperial): 0805; Min Operating Temperature: -55°C; Max Operating Temperature: 155°C; Composition: Thick Film; Tolerance: 1%; Resistance: 100kR; Packaging: Tape and Reel; Voltage Rating: 150V; Package Quantity: 1; Number of Terminations: 2; Termination: SMD/SMT; Military Standard: Not; Max Power Dissipation: 125mW; Features: Moisture Resistant; Length: 2mm; Height: 0.024inch; Width: 0.049inch; Depth: 1.25mm; Lead Pitch: 0.4mm; REACH SVHC: Unknown; Lead Free: Lead Free; ComponentLink1URL: https://datasheet.ciiva.com/11808/0900766b8106beab-11808858.pdf?src-supplier=RSComponents; ComponentLink1Description: https://datasheet.ciiva.com/11808/0900766b8106beab-11808858.pdf?src-supplier=RSComponents; ComponentLink2URL: https://datasheet.ciiva.com/2457/pyu-r-int-thick-7-2457017.pdf?src-supplier=Digi-Key; ComponentLink2Description: https://datasheet.ciiva.com/2457/pyu-r-int-thick-7-2457017.pdf?src-supplier=Digi-Key; ComponentLink3URL: https://datasheet.ciiva.com/12667/rc0805-12667001.pdf?src-supplier=Mouser; ComponentLink3Description: https://datasheet.ciiva.com/12667/rc0805-12667001.pdf?src-supplier=Mouser; ComponentLink4URL: https://datasheet.ciiva.com/2457/pyu-r-int-thick-7-2457018.pdf?src-supplier=Digi-Key; ComponentLink4Description: https://datasheet.ciiva.com/2457/pyu-r-int-thick-7-2457018.pdf?src-supplier=Digi-Key; ComponentLink5URL: https://datasheet.ciiva.com/16747/rc0805-16747226.pdf?src-supplier=Future+Electronics; ComponentLink5Description: https://datasheet.ciiva.com/16747/rc0805-16747226.pdf?src-supplier=Future+Electronics; ComponentLink6URL: https://datasheet.ciiva.com/2457/pyu-r-int-thick-7-2457019.pdf?src-supplier=Digi-Key; ComponentLink6Description: https://datasheet.ciiva.com/2457/pyu-r-int-thick-7-2457019.pdf?src-supplier=Digi-Key; ComponentLink7URL: https://datasheet.ciiva.com/7660/38627-7660796.pdf?src-supplier=Element14; ComponentLink7Description: https://datasheet.ciiva.com/7660/38627-7660796.pdf?src-supplier=Element14; ComponentLink8URL: https://datasheet.ciiva.com/7941/1697719-7941676.pdf?src-supplier=Element14; ComponentLink8Description: https://datasheet.ciiva.com/7941/1697719-7941676.pdf?src-supplier=Element14; ComponentLink9URL: https://datasheet.ciiva.com/7941/1686128-7941677.pdf?src-supplier=Element14; ComponentLink9Description: https://datasheet.ciiva.com/7941/1686128-7941677.pdf?src-supplier=Element14; ComponentLink10URL: https://datasheet.ciiva.com/7941/1697719-7941678.pdf?src-supplier=Element14; ComponentLink10Description: https://datasheet.ciiva.com/7941/1697719-7941678.pdf?src-supplier=Element14; ComponentLink11URL: https://datasheet.ciiva.com/22747/444164-22747534.pdf?src-supplier=Element14; ComponentLink11Description: https://datasheet.ciiva.com/22747/444164-22747534.pdf?src-supplier=Element14
R9 = Resistor: Thin Film Resistors 1/10W 1.5Kohm 0.5% 25ppm; Manufacturer: Susumu; Manufacturer Part Number: RR1220P-152-D; Power Rating: 100mW; Voltage Rating: 100V; Temperature Coefficient: 25ppm/°C; Link: https://www.digikey.com/en/products/detail/susumu/RR1220P-152-D/432295; Supplier 1: Digi-Key; Supplier Part Number 1: RR12P1.5KDCT-ND; RoHS: Yes; Category: Chip SMD Resistors; Stock 1: 22562; Pricing 1: 1=0,10000, 10=0,08500, 100=0,03260, 1000=0,01432, 2500=0,01237 (USD); Case/Package: 0805; Case Code (Metric): 2012; Case Code (Imperial): 0805; Size Code: 0805; Min Operating Temperature: -55°C; Max Operating Temperature: 125°C; Package Quantity: 5000; Packaging: Tape and Reel; Resistance: 1.5kR; Tolerance: 0.5%; Resistor Type: Thin Film; Number of Terminations: 2; Termination: SMD/SMT; Max Power Dissipation: 100mW; Voltage Rating (DC): 100V; Series: RR; Resistance Tolerance: 0.5%; Technology: THIN FILM; Length: 0.079inch; Width: 0.049inch; Height: 0.02inch; Depth: 1.25mm; REACH SVHC: Unknown; Lead Free: Lead Free; RoHS Compliant: Yes; ComponentLink1URL: https://datasheet.ciiva.com/11820/0900766b80808d64-11820669.pdf?src-supplier=RSComponents; ComponentLink1Description: https://datasheet.ciiva.com/11820/0900766b80808d64-11820669.pdf?src-supplier=RSComponents
U1 = BQ27441DRZT-G1B: TEXAS INSTRUMENTS - BQ27441DRZT-G1B - Li-Ion, LiMn2PO4 Battery Fuel Gauge, 2.45 V to 4.5 V supply, I2C interface, SON-12; Number of Cells: 1; Min Supply Voltage: 2.45V; Max Supply Voltage: 4.5V; Output Voltage: 1.8V; Operating Supply Current: 93uA; Capacity: 8000mAh; Output Current: 500uA; Supplier 1: Digi-Key; Manufacturer: Texas Instruments; RoHS: Yes; Category: Battery Management; Stock 1: 1013; Mount: Surface Mount; Number of Pins: 12; Contact Plating: Gold; Min Operating Temperature: -40°C; Max Operating Temperature: 85°C; Package Quantity: 250; Packaging: Tape and Reel; Interface: I2C; REACH SVHC: No SVHC; Lead Free: Lead Free; RoHS Compliant: Yes; ComponentLink1URL: https://datasheet.ciiva.com/46405/1795843-46405045.pdf?src-supplier=Element14; ComponentLink1Description: https://datasheet.ciiva.com/46405/1795843-46405045.pdf?src-supplier=Element14; Link: https://www.digikey.com/en/products/detail/BQ27441DRZT-G1B/296-37272-1-ND/4733021?itemSeq=375639468; Pricing 1: 1=3,10000, 10=2,78700, 25=2,62880, 100=2,23970 (USD); Supplier Part Number 1: 296-37272-1-ND; Manufacturer Part Number: BQ27441DRZT-G1B
U2 = NCV8161BSN330T1G: ON SEMICONDUCTOR - NCV8161BSN330T1G - LDO-FESTSP.REG AEC-Q100 3.3V 0.45A TSOP5; Output Type: Fixed; Output Configuration: Positive; Number of Regulators: 1; Max Input Voltage: 5.5V; Dropout Voltage: 305mV; Output Current: 450mA; Quiescent Current: 23uA; Power Supply Rejection Ratio (PSRR): 48dB; Supplier 1: RSComponents; Manufacturer: ON Semiconductor; RoHS: Yes; Category: Voltage Regulators - Linear; Stock 1: 3700; Mount: Surface Mount; Case/Package: SOT-23-5; Min Operating Temperature: -40°C; Max Operating Temperature: 125°C; Packaging: Cut Tape; Min Output Voltage: 3.3V; RoHS Compliant: Yes; ComponentLink1URL: http://www.farnell.com/datasheets/2290244.pdf?src-supplier=Farnell; ComponentLink1Description: http://www.farnell.com/datasheets/2290244.pdf?src-supplier=Farnell; ComponentLink2URL: http://www.onsemi.com/pub/Collateral/NCV8161-D.PDF?src-supplier=Digi-Key; ComponentLink2Description: http://www.onsemi.com/pub/Collateral/NCV8161-D.PDF?src-supplier=Digi-Key; ComponentLink3URL: http://www.farnell.com/datasheets/2290244.pdf?src-supplier=Newark; ComponentLink3Description: http://www.farnell.com/datasheets/2290244.pdf?src-supplier=Newark; Supplier Part Number 1: 1718403P; Pricing 1: 100=0,33700, 500=0,31900, 1000=0,24400, 3000=0,21900 (GBP); Link: https://www.digikey.com/en/products/detail/NCV8161BSN330T1G/NCV8161BSN330T1GOSCT-ND/7556483?itemSeq=375639462; Manufacturer Part Number: NCV8161BSN330T1G
U3 = BQ24075QRGTRQ1: IC BATTERY MGMT LI-ION 16-QFN; Manufacturer: Texas Instruments; Output Voltage: 4.2V; Max Supply Voltage: 6.4V; Output Current: 1.5A; Number of Cells: 1; Interface: USB; Fault Protection: Over Voltage,Over Temperature,Short Circuit,Reverse Current; Battery Chemistry: LITHIUM-ION; Supplier 1: Digi-Key; RoHS: Yes; Category: Battery Management; Mount: Surface Mount; Case/Package: QFN; Number of Pins: 16; Contact Plating: Gold; Min Operating Temperature: -40°C; Max Operating Temperature: 125°C; Packaging: Tape and Reel; Package Quantity: 3000; Max Charge Current: 1.5A; Battery Pack Voltage: 4.2V; Series: -; Lead Free: Lead Free; RoHS Compliant: Yes; ComponentLink1URL: https://datasheet.ciiva.com/29609/bq24075-q1-29609824.pdf?src-supplier=Digi-Key; ComponentLink1Description: https://datasheet.ciiva.com/29609/bq24075-q1-29609824.pdf?src-supplier=Digi-Key; ComponentLink2URL: https://datasheet.ciiva.com/12237/slusau3b-128558-12237294.pdf?src-supplier=Mouser; ComponentLink2Description: https://datasheet.ciiva.com/12237/slusau3b-128558-12237294.pdf?src-supplier=Mouser; Supplier Part Number 1: 296-36557-1-ND; Pricing 1: 1=2,87000, 10=2,58100, 25=2,43520, 100=2,07490, 250=1,94828, 500=1,70474, 1000=1,60825 (USD); Link: https://www.digikey.com/en/products/detail/BQ24075QRGTRQ1/296-36557-1-ND/4341266?itemSeq=375639473; Manufacturer Part Number: BQ24075QRGTRQ1
U5 = TLS850B0TBV33ATMA1: LDO Regulator Pos 3.3V 0.5A Automotive 6-Pin(5+Tab) TO-263 T/R; Manufacturer: Infineon; Accuracy: 2%; Dropout Voltage: 100mV; Max Supply Voltage: 40V; Output Current: 500mA; Quiescent Current: 20A; Watchdog Timer: No; Output Type: Fixed; Output Configuration: Positive; Number of Regulators: 1; Max Supply Current: 33uA; Power Supply Rejection Ratio (PSRR): 63dB; Supplier 1: Digi-Key; Manufacturer Part Number: TLS850B0TBV33ATMA1; RoHS: Yes; Category: Power Management ICs; Stock 1: 1242; Mount: Surface Mount; Case/Package: TO-263-6; Min Operating Temperature: -40°C; Max Operating Temperature: 150°C; Nominal Output Voltage: 3.3V; Packaging: Cut Tape; Max Input Voltage: 40V; Min Output Voltage: 3.3V; Lead Free: Contains Lead; Halogen Free: Halogen Free; ComponentLink1URL: https://www.infineon.com/dgdl/Infineon-TLS850B0TB V33-DS-v01_00-EN.pdf?fileId=5546d4625fe3678401600cf0f9cb6d40&src-supplier=Digi-Key; ComponentLink1Description: https://www.infineon.com/dgdl/Infineon-TLS850B0TB V33-DS-v01_00-EN.pdf?fileId=5546d4625fe3678401600cf0f9cb6d40&src-supplier=Digi-Key; Supplier Part Number 1: TLS850B0TBV33ATMA1CT-ND; Pricing 1: 1=1,80000, 10=1,61300, 25=1,52160, 100=1,29630, 250=1,21716, 500=1,06502 (USD); Link: https://www.digikey.com/es/products/detail/infineon-technologies/TLS850B0TBV33ATMA1/8627140